# Altium schematic sheet Demo_XM1.SchDoc
size 863 x 558 mm; SheetNumber: 1; SheetTotal: 1
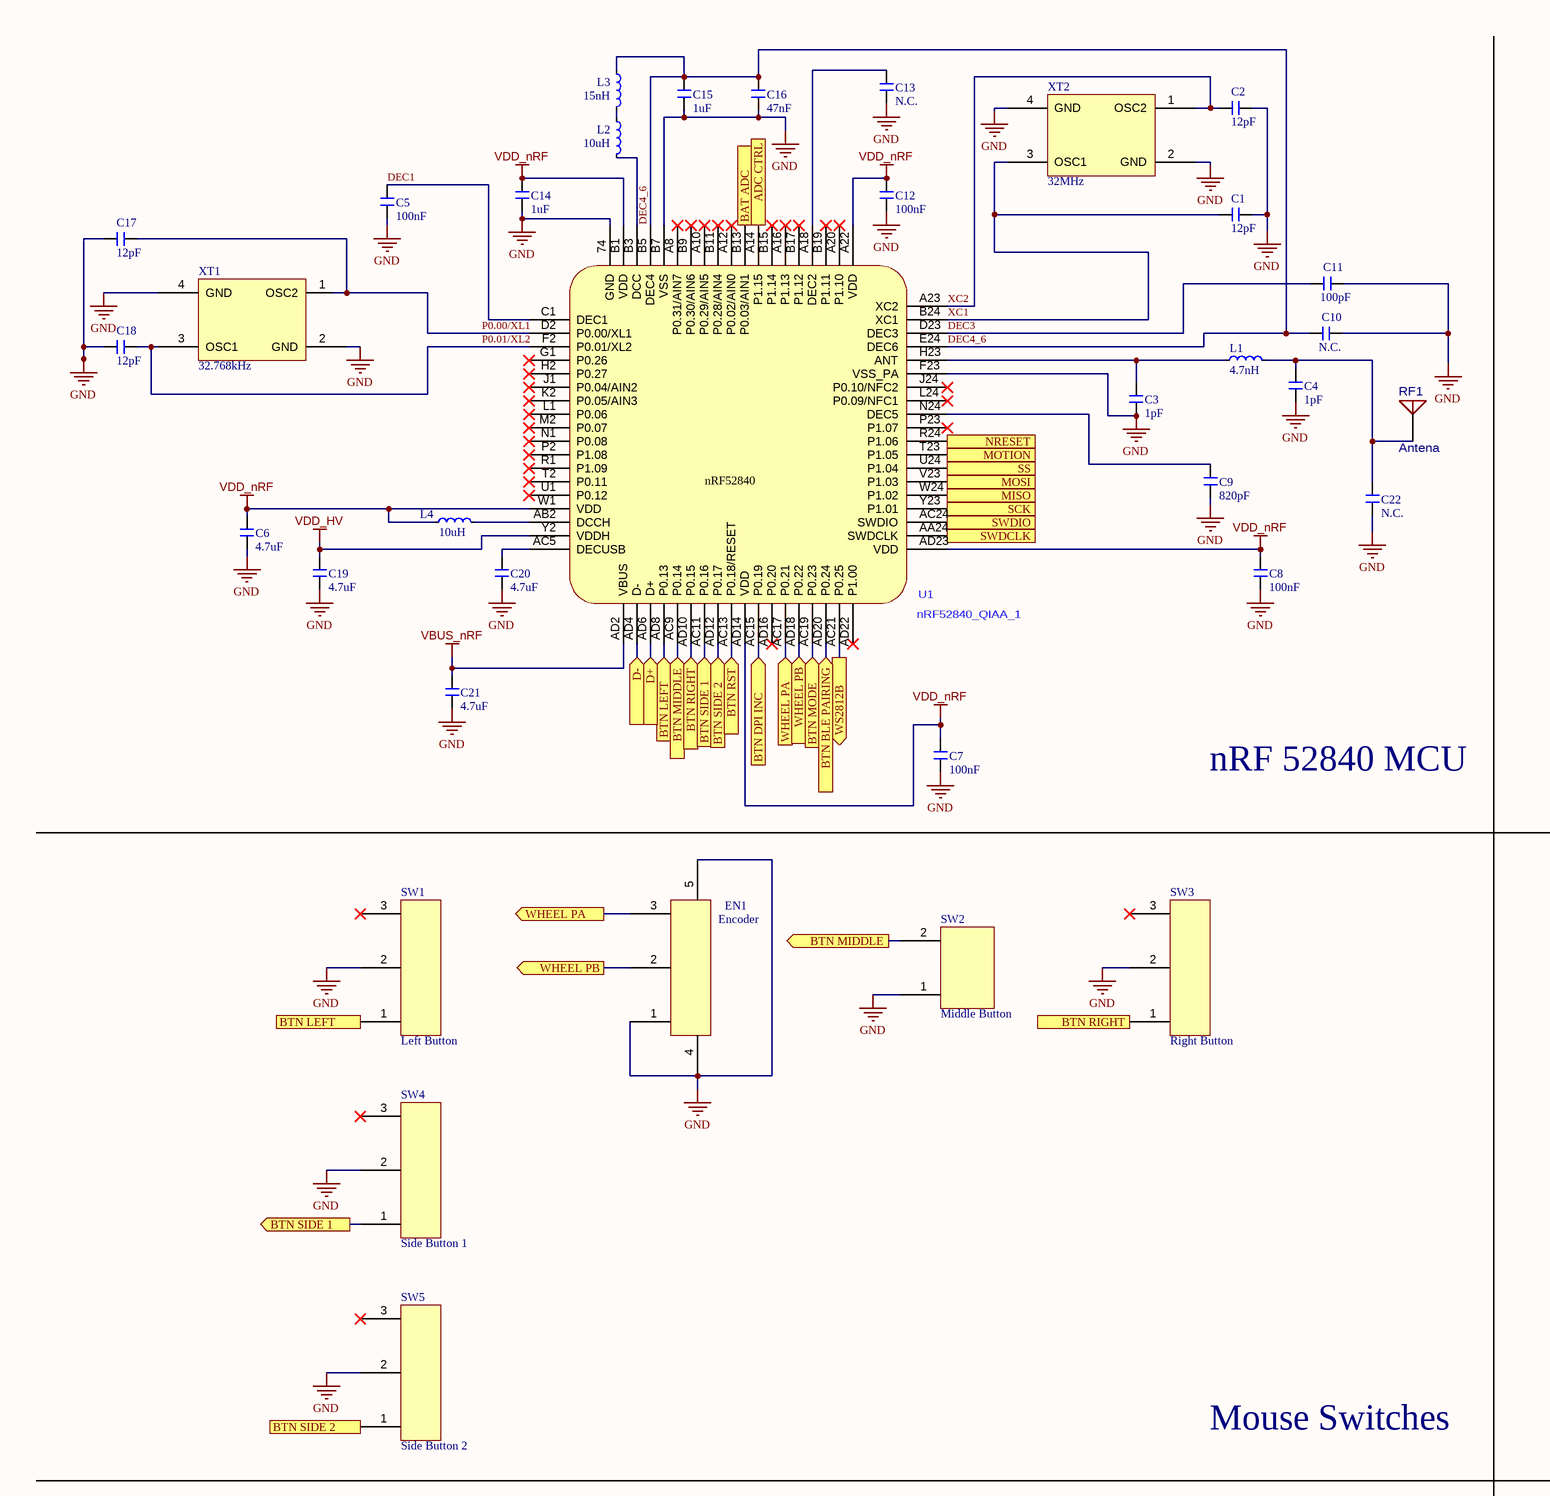
[diagram p0: Demo_XM1.SchDoc, top left]
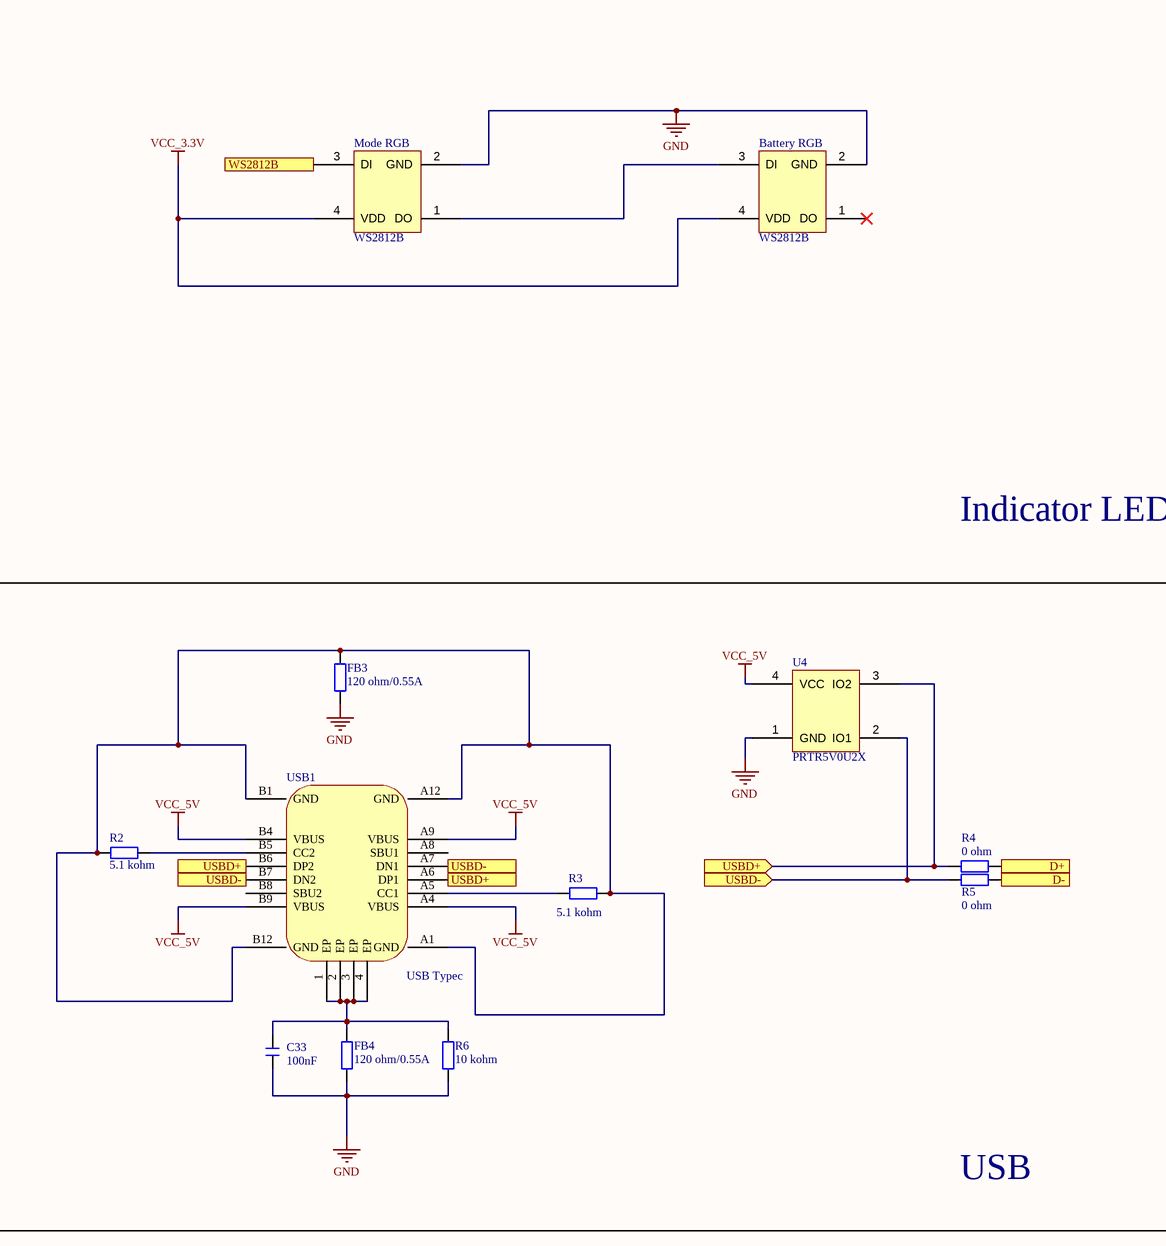
[diagram p1: Demo_XM1.SchDoc, top middle]
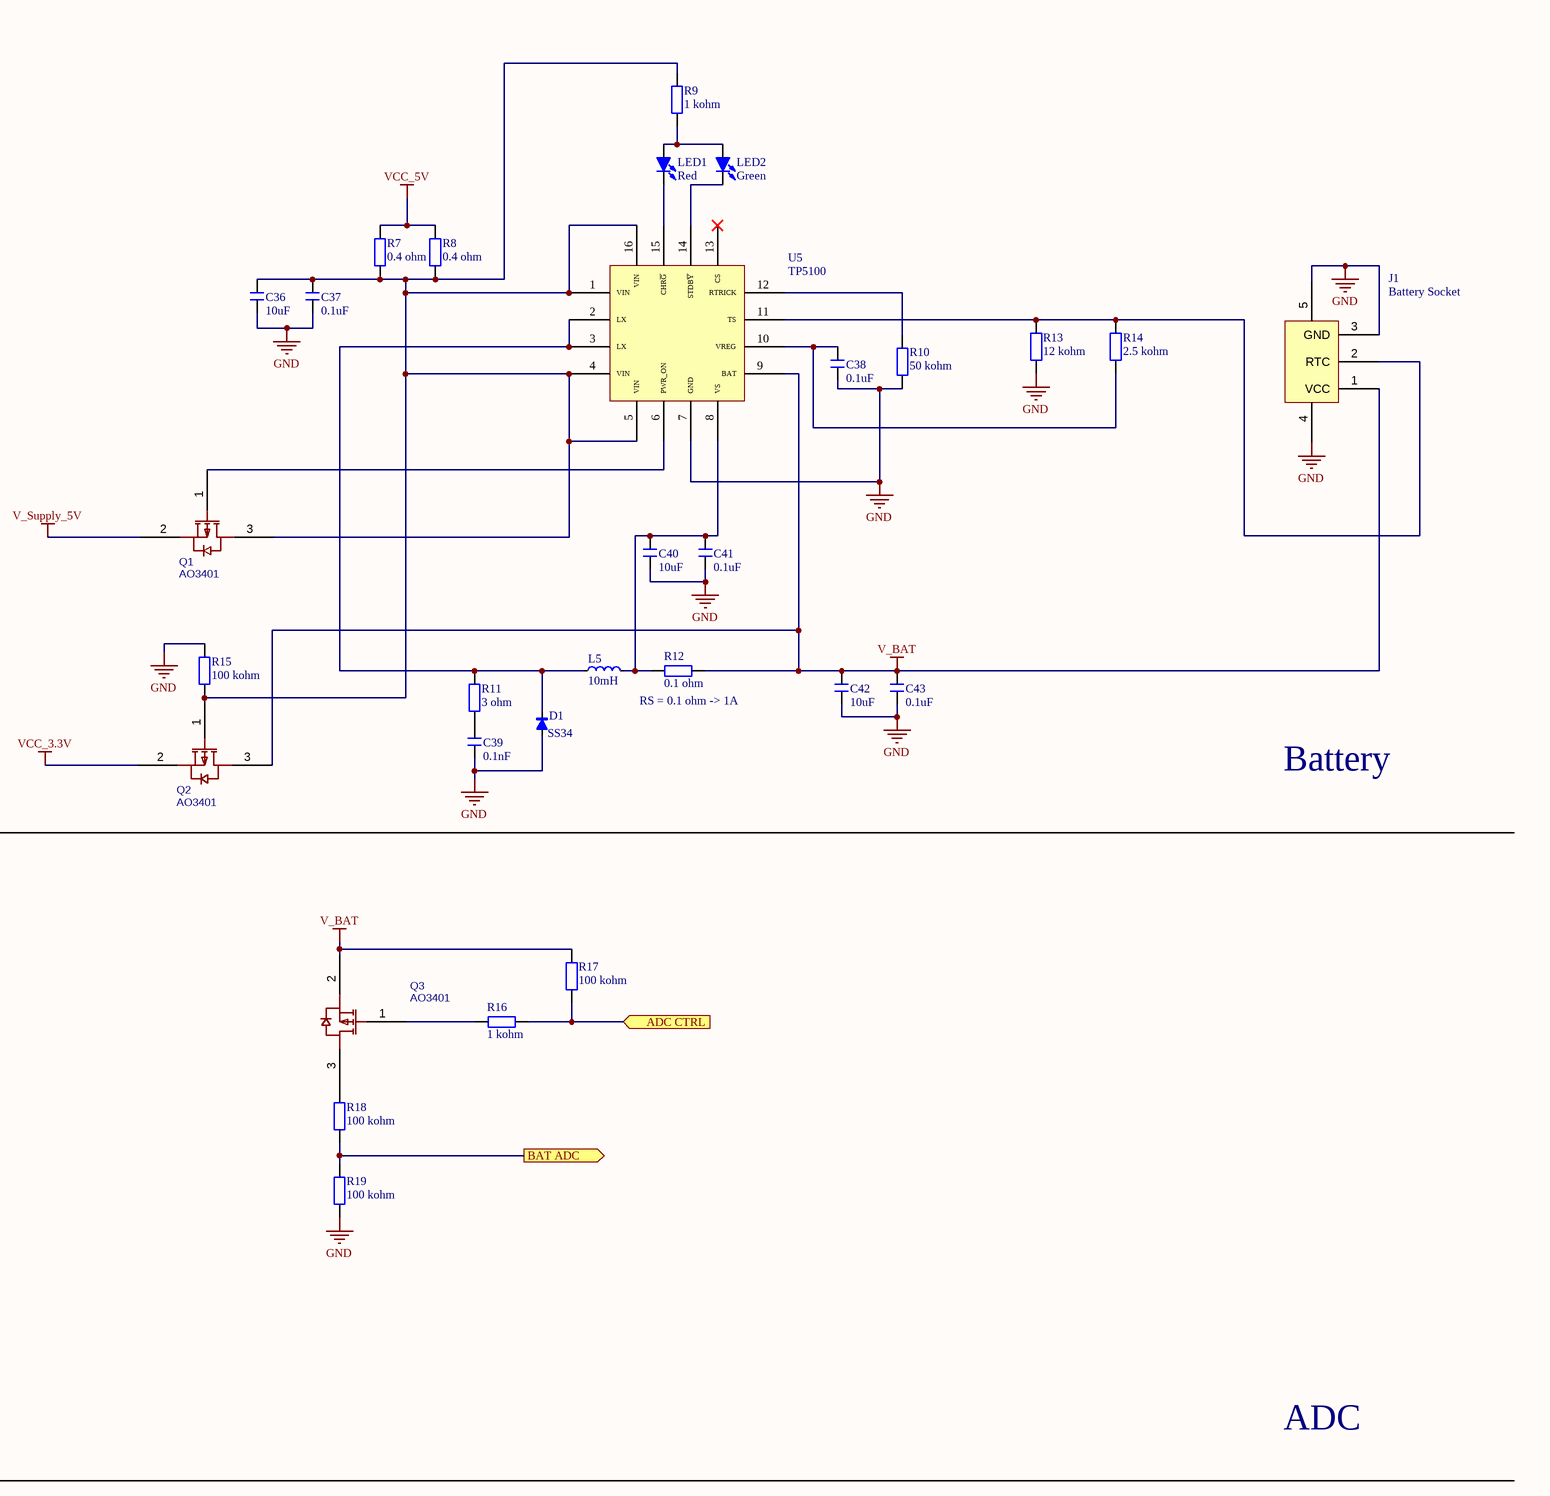
[diagram p2: Demo_XM1.SchDoc, top right]
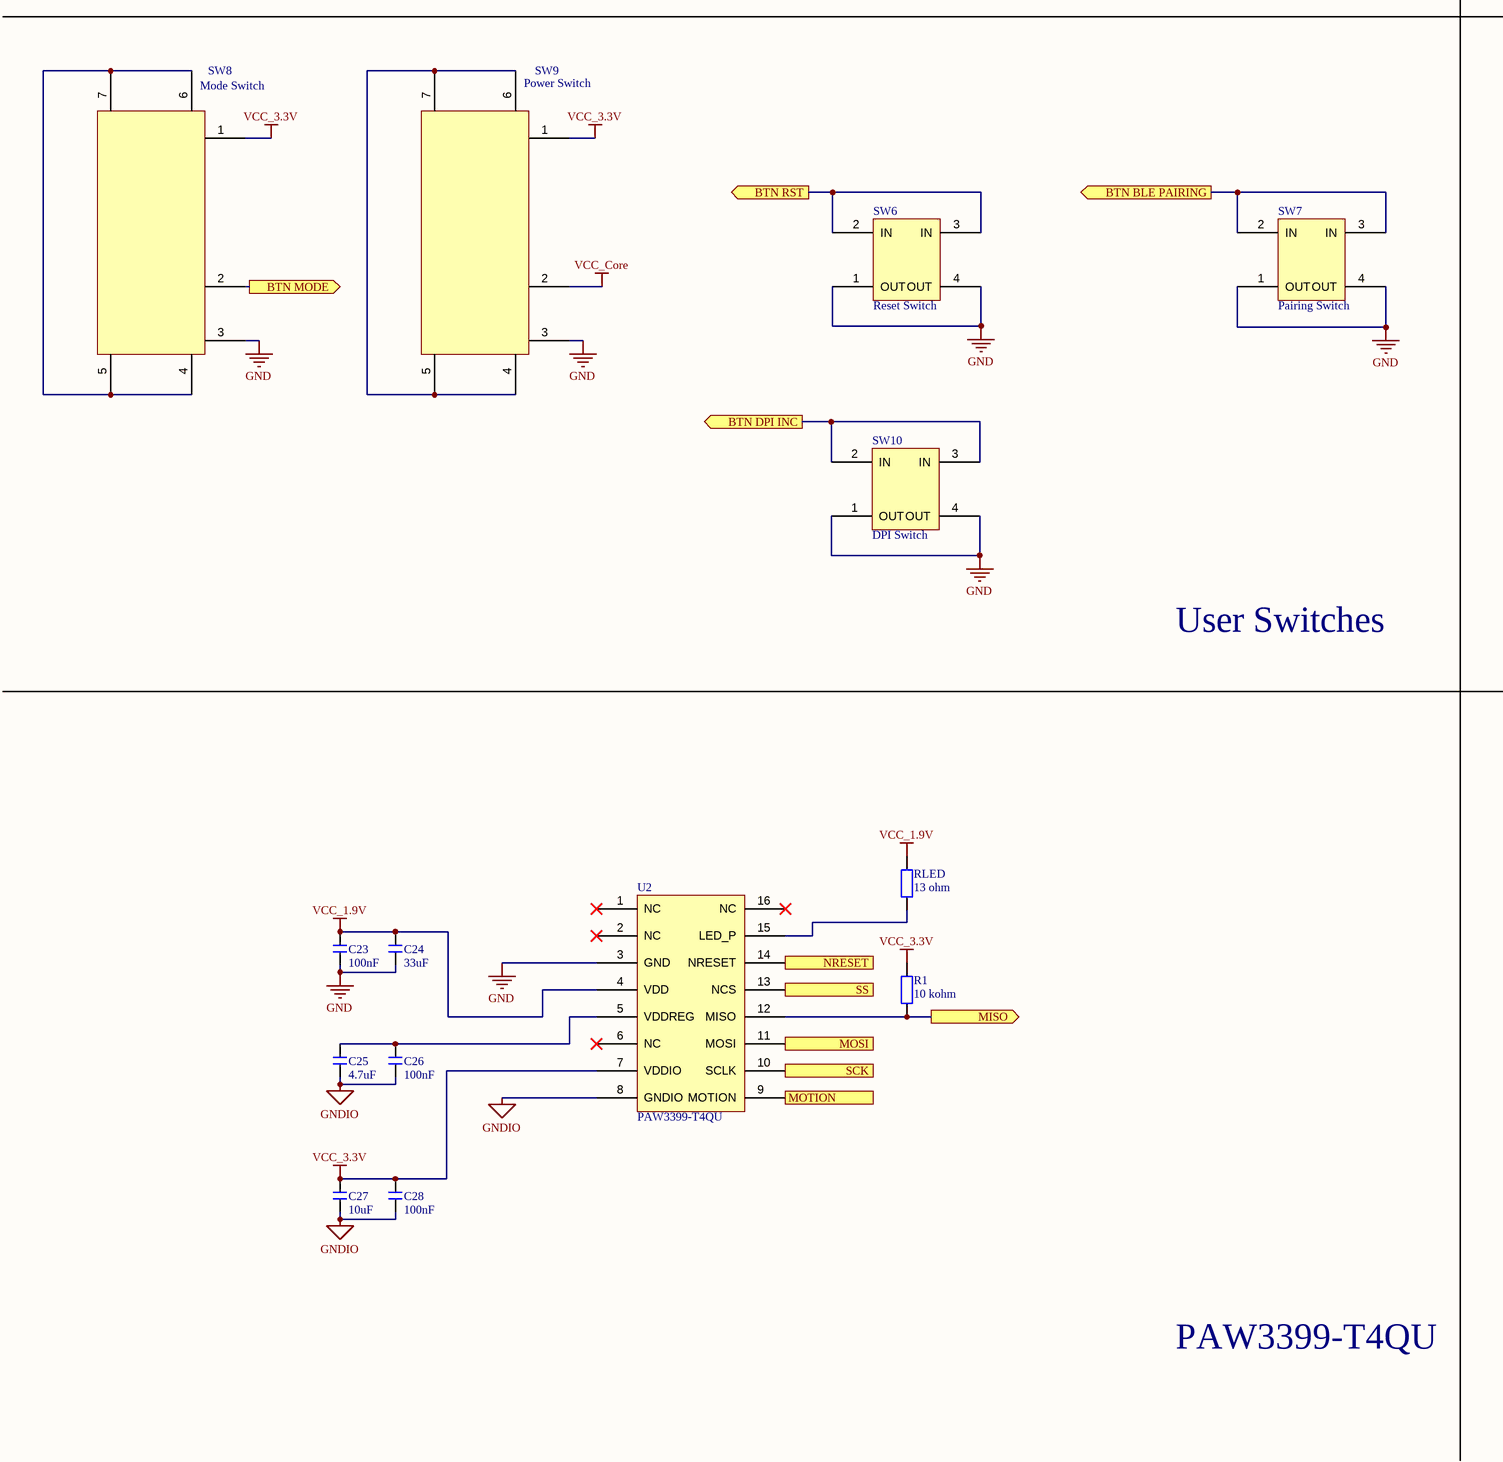
[diagram p3: Demo_XM1.SchDoc, bottom left]
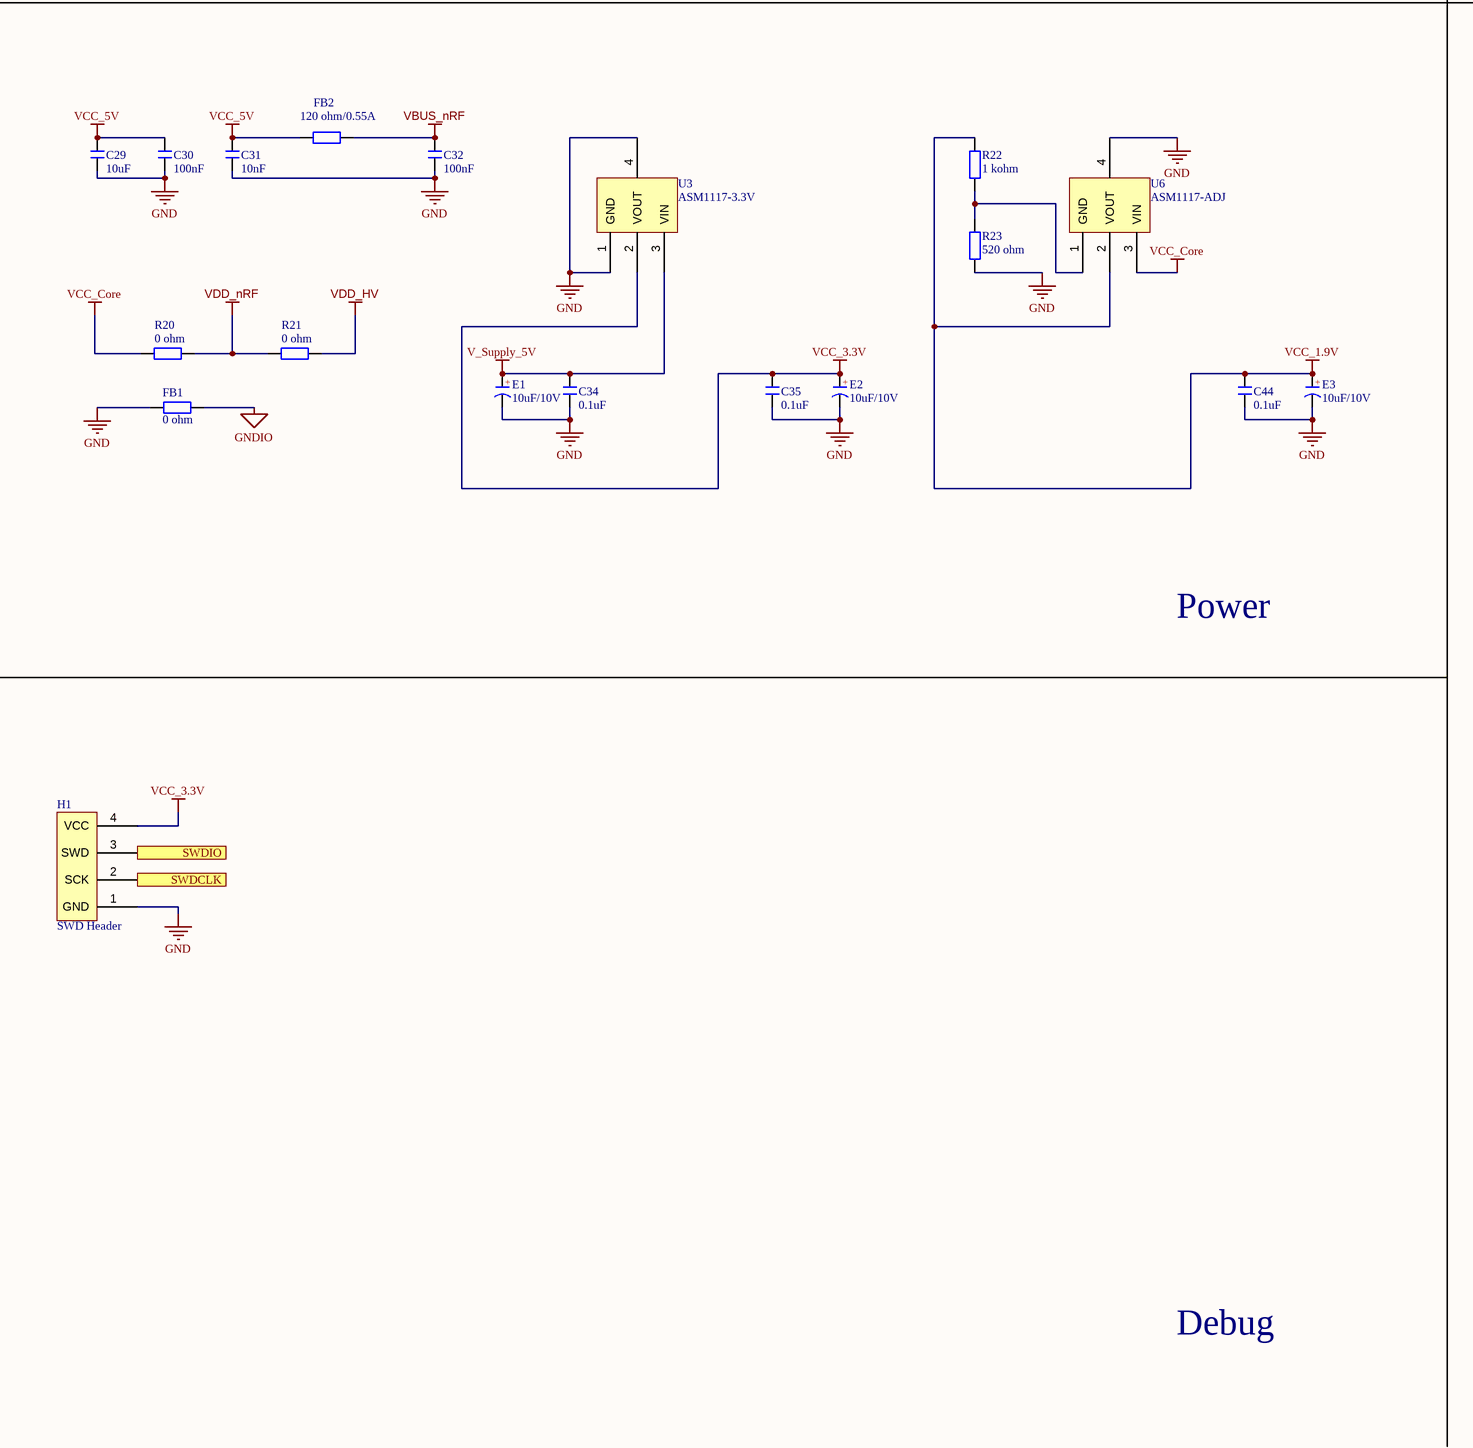
[diagram p4: Demo_XM1.SchDoc, bottom middle]

## Parts
Battery_RGB  WS2812B  [WS2812-5050]
C1  12pF  [0603C]
C2  12pF  [0603C]
C3  1pF  [0603C]
C4  1pF  [0603C]
C5  100nF  [0603C]
C6  4.7uF  [0603C]
C7  100nF  [0603C]
C8  100nF  [0603C]
C9  820pF  [0603C]
C10  N.C.  [0603C]
C11  100pF  [0603C]
C12  100nF  [0603C]
C13  N.C.  [0603C]
C14  1uF  [0603C]
C15  1uF  [0603C]
C16  47nF  [0603C]
C17  12pF  [0603C]
C18  12pF  [0603C]
C19  4.7uF  [0603C]
C20  4.7uF  [0603C]
C21  4.7uF  [0603C]
C22  N.C.  [0603C]
C23  100nF  [0603C]
C24  33uF  [0603C]
C25  4.7uF  [0603C]
C26  100nF  [0603C]
C27  10uF  [0603C]
C28  100nF  [0603C]
C29  10uF  [0603C]
C30  100nF  [0603C]
C31  10nF  [0603C]
C32  100nF  [0603C]
C33  100nF  [0603C]
C34  0.1uF  [0603C]
C35  0.1uF  [0603C]
C36  10uF  [0603C]
C37  0.1uF  [0603C]
C38  0.1uF  [0603C]
C39  0.1nF  [0603C]
C40  10uF  [0603C]
C41  0.1uF  [0603C]
C42  10uF  [0603C]
C43  0.1uF  [0603C]
C44  0.1uF  [0603C]
D1  SS34  [0603D]
E1  10uF/10V  [DIP-EC2.0X5X11]
E2  10uF/10V  [DIP-EC2.0X5X11]
E3  10uF/10V  [DIP-EC2.0X5X11]
EN1  Encoder  [ENCODER FOP MOUSE]
FB1  0 ohm  [0603C]
FB2  120 ohm/0.55A  [0603C]
FB3  120 ohm/0.55A  [0603C]
FB4  120 ohm/0.55A  [0603C]
H1  SWD Header  [CON20VP2R54-1X4TM]
J1  Battery Socket  [BAT SH1.0]
L1  4.7nH  [0603C]
L2  10uH  [0603C]
L3  15nH  [0603C]
L4  10uH  [0603C]
L5  10mH  [L 1.2*1.7]
LED1  Red  [0603c]
LED2  Green  [0603c]
Mode_RGB  WS2812B  [WS2812-5050]
Q1  AO3401  [SOT23-3]
Q2  AO3401  [SOT23-3]
Q3  AO3401  [SOT23-3]
R1  10 kohm  [0603C]
R2  5.1 kohm  [0603C]
R3  5.1 kohm  [0603C]
R4  0 ohm  [0603C]
R5  0 ohm  [0603C]
R6  10 kohm  [0603C]
R7  0.4 ohm  [1206C]
R8  0.4 ohm  [1206C]
R9  1 kohm  [0603C]
R10  50 kohm  [0603C]
R11  3 ohm  [0603C]
R12  0.1 ohm  [0603C]
R13  12 kohm  [0603C]
R14  2.5 kohm  [0603C]
R15  100 kohm  [0603C]
R16  1 kohm  [0603C]
R17  100 kohm  [0603C]
R18  100 kohm  [0603C]
R19  100 kohm  [0603C]
R20  0 ohm  [0603C]
R21  0 ohm  [0603C]
R22  1 kohm  [0603C]
R23  520 ohm  [0603C]
RF1  Antena  [CrossAir CA-C03]
RLED  13 ohm  [0603C]
SW1  Left Button  [MOUSE SWITCH]
SW2  Middle Button  [X5 MIDDLE BOTTOM SET]
SW3  Right Button  [MOUSE SWITCH]
SW4  Side Button 1  [MOUSE SWITCH]
SW5  Side Button 2  [MOUSE SWITCH]
SW6  Reset Switch  [touch switch - dey]
SW7  Pairing Switch  [touch switch - dey]
SW8  Mode Switch  [MSK 12C02]
SW9  Power Switch  [MSK 12C02]
SW10  DPI Switch  [touch switch]
U1  nRF52840_QIAA_1  [AQFN50P700X700X85_HS-74N]
U2  PAW3399-T4QU  [PAW3399-T4QU]
U3  ASM1117-3.3V  [SOT223]
U4  PRTR5V0U2X  [SOT143]
U5  TP5100  [QFN4X4-16-1]
U6  ASM1117-ADJ  [SOT223]
USB1  USB Typec  [USB-C-SMD_KH-TYPE-C-16P]
XT1  32.768kHz  [CRYSTAL FOR XT1]
XT2  32MHz  [CRYSTAL FOR XT1]

## Ports
ADC CTRL (in, see Demo_XM1[11J]), ADC CTRL (out, see Demo_XM1[3G]), BAT ADC (in, see Demo_XM1[3G]), BAT ADC (out, see Demo_XM1[11J]), BTN BLE PAIRING (in, see Demo_XM1[10E]), BTN BLE PAIRING (out, see Demo_XM1[10H]), BTN DPI INC (in, see Demo_XM1[11D]), BTN DPI INC (out, see Demo_XM1[11H]), BTN LEFT (in, see Demo_XM1[12G]), BTN LEFT (out, see Demo_XM1[11H]), BTN MIDDLE (in, see Demo_XM1[10G]), BTN MIDDLE (out, see Demo_XM1[11H]), BTN MODE (in, see Demo_XM1[12E]), BTN MODE (out, see Demo_XM1[10H]), BTN RIGHT (in, see Demo_XM1[10G]), BTN RIGHT (out, see Demo_XM1[11H]), BTN RST (in, see Demo_XM1[10E]), BTN RST (out, see Demo_XM1[11H]), BTN SIDE 1 (in, see Demo_XM1[12F]), BTN SIDE 1 (out, see Demo_XM1[11H]), BTN SIDE 2 (in, see Demo_XM1[12F]), BTN SIDE 2 (out, see Demo_XM1[11H]), D+ (in, see Demo_XM1[5G]), D+ (out, see Demo_XM1[11H]), D- (in, see Demo_XM1[5G]), D- (out, see Demo_XM1[11H]), MISO (in, see Demo_XM1[10B]), MISO (out, see Demo_XM1[10I]), MOSI (in, see Demo_XM1[10I]), MOSI (out, see Demo_XM1[10B]), MOTION (in, see Demo_XM1[10B]), MOTION (out, see Demo_XM1[10I]), NRESET (in, see Demo_XM1[10B]), NRESET (out, see Demo_XM1[10I]), SCK (in, see Demo_XM1[10B]), SCK (out, see Demo_XM1[10I]), SS (in, see Demo_XM1[10B]), SS (out, see Demo_XM1[10I]), SWDCLK (in, see Demo_XM1[8C]), SWDCLK (out, see Demo_XM1[10I]), SWDIO (in, see Demo_XM1[8C]), SWDIO (out, see Demo_XM1[10I]), USBD+ (in, see Demo_XM1[7G]), USBD+ (out, see Demo_XM1[6G], Demo_XM1[7G]), USBD- (in, see Demo_XM1[7G]), USBD- (out, see Demo_XM1[6G], Demo_XM1[7G]), WHEEL PA (in, see Demo_XM1[11G]), WHEEL PA (out, see Demo_XM1[10H]), WHEEL PB (in, see Demo_XM1[11G]), WHEEL PB (out, see Demo_XM1[10H]), WS2812B (in, see Demo_XM1[10H]), WS2812B (out, see Demo_XM1[7I])

## Nets
GND: Battery_RGB.2(GND) C1.2 C2.2 C3.1 C4.1 C5.2 C6.1 C7.1 C8.1 C9.1 C10.2 C11.2 C12.1 C13.1 C14.2 C15.1 C16.1 C17.1 C18.1 C19.1 C20.1 C21.1 C22.1 C23.1 C24.2 C29.1 C30.1 C31.1 C32.1 C33.1 C34.1 C35.1 C36.1 C37.1 C38.1 C39.1 C40.1 C41.1 C42.1 C43.1 C44.1 D1.1(A) E1.2(K) E2.2(K) E3.2(K) EN1.1 EN1.4 EN1.5 FB1.1 FB3.1 FB4.1 H1.1(GND) J1.3(GND) J1.4(GND) J1.5(GND) Mode_RGB.2(GND) R6.1 R10.1 R13.1 R15.2 R19.2 R23.2 SW1.2 SW2.1 SW3.2 SW4.2 SW5.2 SW6.1(OUT) SW6.4(OUT) SW7.1(OUT) SW7.4(OUT) SW8.3 SW9.3 SW10.1(OUT) SW10.4(OUT) U1.74(GND) U1.B7(VSS) U1.F23(VSS_PA) U2.3(GND) U3.1(GND) U3.4(GND) U4.1(GND) U5.7(GND) U6.4(GND) XT1.2(GND) XT1.4(GND) XT2.2(GND) XT2.4(GND)
GNDIO: C25.1 C26.2 C27.1 C28.1 FB1.2 U2.8(GNDIO)
V_BAT: C42.2 C43.2 J1.1(VCC) Q2.3(D) Q3.2(S) R12.1 R17.1 U5.9(BAT)
V_Supply_5V: C34.2 E1.1(A) Q1.2(S) U3.3(VIN)
VBUS_nRF: C21.2 C32.2 FB2.2 U1.AD2(VBUS)
VCC_1.9V: C23.2 C24.1 C44.2 E3.1(A) R22.1 RLED.2 U2.4(VDD) U6.2(VOUT)
VCC_3.3V: Battery_RGB.4(VDD) C27.2 C28.2 C35.2 E2.1(A) H1.4(VCC) Mode_RGB.4(VDD) Q2.2(S) R1.2 SW8.1 SW9.1 U2.7(VDDIO) U3.2(VOUT)
VCC_5V: C29.2 C30.2 C31.2 FB2.1 R7.2 R8.2 U4.4(VCC) USB1.A4(VBUS) USB1.A9(VBUS) USB1.B4(VBUS) USB1.B9(VBUS)
VCC_Core: R20.2 SW9.2 U6.3(VIN)
VDD_HV: C19.2 R21.1 U1.Y2(VDDH)
VDD_nRF: C6.2 C7.2 C8.2 C12.2 C14.1 L4.1 R20.1 R21.2 U1.A22(VDD) U1.AD14(VDD) U1.AD23(VDD) U1.B1(VDD) U1.W1(VDD)
ADC CTRL: R16.1 R17.2 U1.A14(P1.15) ; port ADC CTRL
BAT ADC: R18.2 R19.1 U1.B13(P0.03/AIN1) ; port BAT ADC
BTN BLE PAIRING: SW7.2(IN) SW7.3(IN) U1.AD20(P0.24) ; port BTN BLE PAIRING
BTN DPI INC: SW10.2(IN) SW10.3(IN) U1.AC15(P0.19) ; port BTN DPI INC
BTN LEFT: SW1.1 U1.AD8(P0.13) ; port BTN LEFT
BTN MIDDLE: SW2.2 U1.AC9(P0.14) ; port BTN MIDDLE
BTN MODE: SW8.2 U1.AC19(P0.23) ; port BTN MODE
BTN RIGHT: SW3.1 U1.AD10(P0.15) ; port BTN RIGHT
BTN RST: SW6.2(IN) SW6.3(IN) U1.AC13(P0.18/RESET) ; port BTN RST
BTN SIDE 1: SW4.1 U1.AC11(P0.16) ; port BTN SIDE 1
BTN SIDE 2: SW5.1 U1.AD12(P0.17) ; port BTN SIDE 2
D+: R4.1 U1.AD6(D+) ; port D+
D-: R5.1 U1.AD4(D-) ; port D-
DEC1: C5.1 U1.C1(DEC1)
DEC3: C11.1 U1.D23(DEC3)
DEC4_6: C10.1 C15.2 C16.2 L3.1 U1.B5(DEC4) U1.E24(DEC6)
MISO: R1.1 U1.W24(P1.02) U2.12(MISO) ; port MISO
MOSI: U1.V23(P1.03) U2.11(MOSI) ; port MOSI
MOTION: U1.T23(P1.05) U2.9(MOTION) ; port MOTION
NRESET: U1.R24(P1.06) U2.14(NRESET) ; port NRESET
P0.00/XL1: C17.2 U1.D2(P0.00/XL1) XT1.1(OSC2)
P0.01/XL2: C18.2 U1.F2(P0.01/XL2) XT1.3(OSC1)
SCK: U1.Y23(P1.01) U2.10(SCLK) ; port SCK
SS: U1.U24(P1.04) U2.13(NCS) ; port SS
SWDCLK: H1.2(SCK) U1.AA24(SWDCLK) ; port SWDCLK
SWDIO: H1.3(SWD) U1.AC24(SWDIO) ; port SWDIO
USBD+: R4.2 U4.3(IO2) USB1.A6(DP1) USB1.B6(DP2) ; port USBD+
USBD-: R5.2 U4.2(IO1) USB1.A7(DN1) USB1.B7(DN2) ; port USBD-
WHEEL PA: EN1.3 U1.AC17(P0.21) ; port WHEEL PA
WHEEL PB: EN1.2 U1.AD18(P0.22) ; port WHEEL PB
WS2812B: Mode_RGB.3(DI) U1.AC21(P0.25) ; port WS2812B
XC1: C1.1 U1.B24(XC1) XT2.3(OSC1)
XC2: C2.1 U1.A23(XC2) XT2.1(OSC2)
NetBattery_RGB_3: Battery_RGB.3(DI) Mode_RGB.1(DO)
NetC3_2: C3.2 L1.1 U1.H23(ANT)
NetC4_2: C4.2 C22.2 L1.2 RF1.5
NetC9_2: C9.2 U1.N24(DEC5)
NetC13_2: C13.2 U1.A18(DEC2)
NetC20_2: C20.2 U1.AC5(DECUSB)
NetC25_2: C25.2 C26.1 U2.5(VDDREG)
NetC33_2: C33.2 FB4.2 R6.2 USB1.1(EP) USB1.2(EP) USB1.3(EP) USB1.4(EP)
NetC36_2: C36.2 C37.2 Q1.3(D) Q2.1(G) R7.1 R8.1 R9.2 R15.1 U5.1(VIN) U5.4(VIN) U5.5(VIN) U5.16(VIN)
NetC38_2: C38.2 R14.1 U5.10(VREG)
NetC39_2: C39.2 R11.1
NetC40_2: C40.2 C41.2 L5.2 R12.2 U5.8(VS)
NetD1_2: D1.2(K) L5.1 R11.2 U5.2(LX) U5.3(LX)
NetFB3_2: FB3.2 R2.1 R3.2 USB1.A1(GND) USB1.A12(GND) USB1.B1(GND) USB1.B12(GND)
NetJ1_2: J1.2(RTC) R13.2 R14.2 U5.11(TS)
NetL2_1: L2.1 L3.2
NetL2_2: L2.2 U1.B3(DCC)
NetL4_2: L4.2 U1.AB2(DCCH)
NetLED1_1: LED1.1 U5.15(CHR~{G})
NetLED1_2: LED1.2 LED2.2 R9.1
NetLED2_1: LED2.1 U5.14(STDB~{Y})
NetQ1_1: Q1.1(G) U5.6(PWR_ON)
NetQ3_1: Q3.1(G) R16.2
NetQ3_3: Q3.3(D) R18.1
NetR2_2: R2.2 USB1.B5(CC2)
NetR3_1: R3.1 USB1.A5(CC1)
NetR10_2: R10.2 U5.12(RTRICK)
NetR22_2: R22.2 R23.1 U6.1(GND)
NetRLED_1: RLED.1 U2.15(LED_P)
NetSW8_4: SW8.4 SW8.5 SW8.6 SW8.7
NetSW9_4: SW9.4 SW9.5 SW9.6 SW9.7

Not connected (* = marked no-connect by the designer): Battery_RGB 1(DO)*; SW1 3*; SW3 3*; SW4 3*; SW5 3*; U1 A8(P0.31/AIN7)* A10(P0.29/AIN5)* A12(P0.02/AIN0)* A16(P1.13)* A20(P1.10)* AD16(P0.20)* AD22(P1.00)* B9(P0.30/AIN6)* B11(P0.28/AIN4)* B15(P1.14)* B17(P1.12)* B19(P1.11)* G1(P0.26)* H2(P0.27)* J1(P0.04/AIN2)* J24(P0.10/NFC2)* K2(P0.05/AIN3)* L1(P0.06)* L24(P0.09/NFC1)* M2(P0.07)* N1(P0.08)* P2(P1.08)* P23(P1.07)* R1(P1.09)* T2(P0.11)* U1(P0.12)*; U2 1(NC)* 2(NC)* 6(NC)* 16(NC)*; U5 13(CS)*; USB1 A8(SBU1) B8(SBU2)

## Notes on the sheet
- RS = 0.1 ohm -> 1A
- nRF 52840 MCU
- Indicator LED
- Battery
- Mouse Switches
- USB
- ADC
- User Switches
- Power
- PAW3399-T4QU
- Debug
- DWG. NO.
- REV.
- SHT.
- REVISION
- DESCRIPTION
- DATE
- APPROVED
- THIS DOCUMENT AND THE DATA DISCLOSED HEREIN OR HEREWITH IS THE PROPERTY OF ALTIUM LIMITED AND MAY BE FREELY DISTRIBUTED IN WHOLE. NO RIGHTS ARE RESERVED OR EXPRESS OR IMPLIED WARANTEE GIVEN.
- ENG:
- DSN:
- APPROVALS
- PROJECT
- DOCUMENT REVISION:
- DESIGN ITEM:
- CHK:
- BOM:
- REFERENCE DOCUMENTS
- PROJECT REVISION:
- TITLE
- FAB DWG:
- PCB DWG:
- ASSY DWG:
- SCALE:
- SIZE
- D
- CAGE CODE
- FILE NAME
- DWG NO.
- SHEET
- OF
- REV
- (in symbol Polarized Electrolytic Capacitor) +

## Library data of the parts
Battery_RGB Mode_RGB = WS2812B: RGB灯
C1-C44 = Capacitor: 贴片电容
D1 = Diode: 开关二极管; BOM名称: 肖特基二极管; 版权归属: 源创客; 属性: 100V/5A; 学习资源: www.ooocke.com
E1-E3 = Polarized Electrolytic Capacitor: 直插电解电容; 版权归属: 源创客; BOM名称: 直插电解电容; 学习资源: www.ooocke.com
EN1 = Encoder: 编码器
FB1 = Resistor: 磁珠 Ferrite Bead; BOM名称: 贴片电阻
FB2-FB4 R1-R23 RLED = Resistor: 贴片电阻; BOM名称: 贴片电阻
H1 = SWD Header: SWD烧录接口
J1 = Battery Socket: 电池插座
L1-L5 = Inductor: 电感
LED1 LED2 = LED
Q1-Q3 = AO3401: AO3401 PMOS; Manufacturer: TWGMC; Contributor: LCSC; Supplier: LCSC; Supplier Part: C727156; Manufacturer Part: AO3401; JLCPCB Part Class: Extended Part; spicePre: Q; spiceSymbolName: AO3401_C727156
RF1 = Antena: 天线
SW1 SW3-SW5 = Switch: 微动
SW2 = Middle Button: 中键
SW6 SW7 SW10 = Touch Switch: 轻触开关
SW8 SW9 = Slide Switch: 拨动开关
U1 = nRF52840_QIAA_1: nRF52840
U3 U6 = ASM1117: LDO
U4 = PRTR5V0U2X: ESD保护二极管
U5 = TP5100: 锂电池充电模块
USB1 = USB Typec: USB TYPEC 接口
XT1 XT2 = Crystal: 晶振